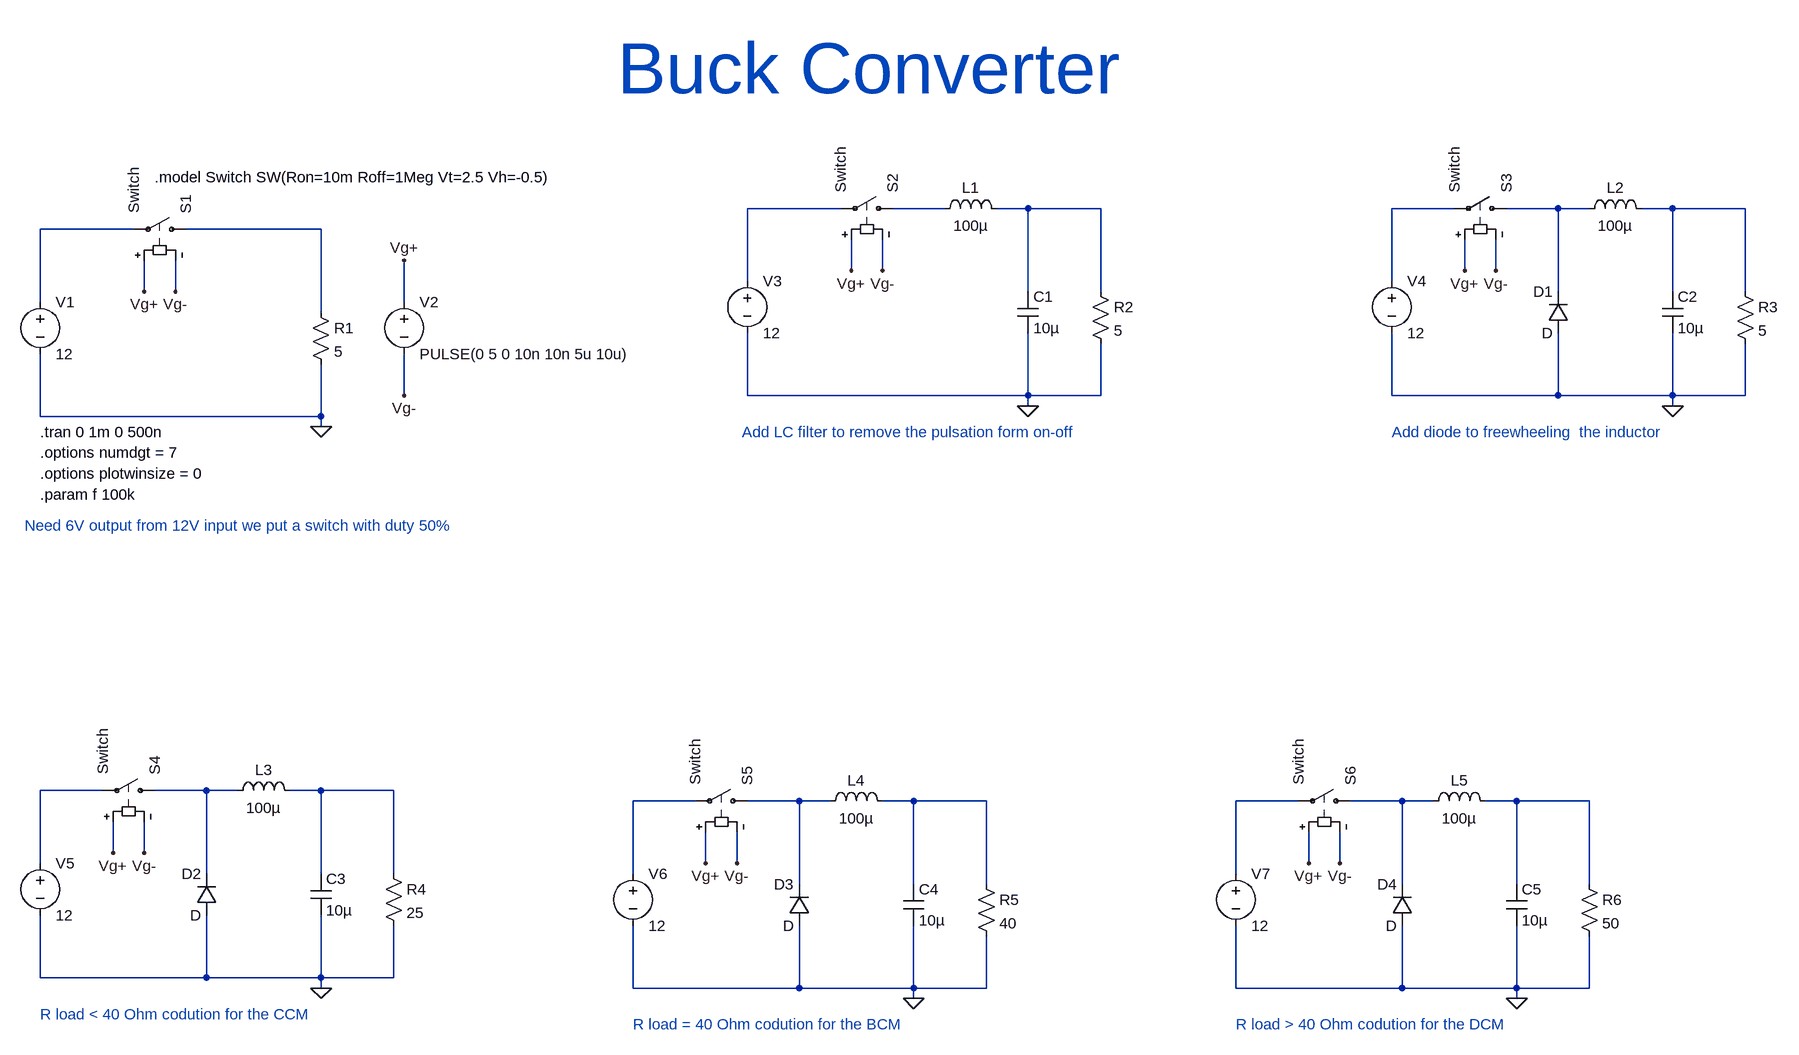
[diagram p0: schematic Buck Converter.asc]
Buck Converter.asc, the LTspice schematic file:
Version 4
SHEET 1 2696 1320
WIRE 1248 16 1104 16
WIRE 1408 16 1328 16
WIRE 1536 16 1488 16
WIRE 1648 16 1536 16
WIRE 2192 16 2096 16
WIRE 2352 16 2272 16
WIRE 2400 16 2352 16
WIRE 2528 16 2480 16
WIRE 2640 16 2528 16
WIRE 160 48 16 48
WIRE 448 48 240 48
WIRE 1264 112 1264 64
WIRE 1312 112 1312 64
WIRE 2208 112 2208 64
WIRE 2256 112 2256 64
WIRE 1104 128 1104 16
WIRE 2096 128 2096 16
WIRE 176 144 176 96
WIRE 224 144 224 96
WIRE 1536 144 1536 16
WIRE 1648 144 1648 16
WIRE 2352 144 2352 16
WIRE 2528 144 2528 16
WIRE 2640 144 2640 16
WIRE 16 160 16 48
WIRE 576 160 576 96
WIRE 448 176 448 48
WIRE 576 304 576 240
WIRE 1104 304 1104 208
WIRE 1536 304 1536 208
WIRE 1536 304 1104 304
WIRE 1648 304 1648 224
WIRE 1648 304 1536 304
WIRE 2096 304 2096 208
WIRE 2352 304 2352 208
WIRE 2352 304 2096 304
WIRE 2528 304 2528 208
WIRE 2528 304 2352 304
WIRE 2640 304 2640 224
WIRE 2640 304 2528 304
WIRE 1536 320 1536 304
WIRE 2528 320 2528 304
WIRE 16 336 16 240
WIRE 448 336 448 256
WIRE 448 336 16 336
WIRE 448 352 448 336
WIRE 112 912 16 912
WIRE 272 912 192 912
WIRE 320 912 272 912
WIRE 448 912 400 912
WIRE 560 912 448 912
WIRE 1024 928 928 928
WIRE 1184 928 1104 928
WIRE 1232 928 1184 928
WIRE 1360 928 1312 928
WIRE 1472 928 1360 928
WIRE 1952 928 1856 928
WIRE 2112 928 2032 928
WIRE 2160 928 2112 928
WIRE 2288 928 2240 928
WIRE 2400 928 2288 928
WIRE 128 1008 128 960
WIRE 176 1008 176 960
WIRE 16 1024 16 912
WIRE 1040 1024 1040 976
WIRE 1088 1024 1088 976
WIRE 1968 1024 1968 976
WIRE 2016 1024 2016 976
WIRE 272 1040 272 912
WIRE 448 1040 448 912
WIRE 560 1040 560 912
WIRE 928 1040 928 928
WIRE 1856 1040 1856 928
WIRE 1184 1056 1184 928
WIRE 1360 1056 1360 928
WIRE 1472 1056 1472 928
WIRE 2112 1056 2112 928
WIRE 2288 1056 2288 928
WIRE 2400 1056 2400 928
WIRE 16 1200 16 1104
WIRE 272 1200 272 1104
WIRE 272 1200 16 1200
WIRE 448 1200 448 1104
WIRE 448 1200 272 1200
WIRE 560 1200 560 1120
WIRE 560 1200 448 1200
WIRE 448 1216 448 1200
WIRE 928 1216 928 1120
WIRE 1184 1216 1184 1120
WIRE 1184 1216 928 1216
WIRE 1360 1216 1360 1120
WIRE 1360 1216 1184 1216
WIRE 1472 1216 1472 1136
WIRE 1472 1216 1360 1216
WIRE 1856 1216 1856 1120
WIRE 2112 1216 2112 1120
WIRE 2112 1216 1856 1216
WIRE 2288 1216 2288 1120
WIRE 2288 1216 2112 1216
WIRE 2400 1216 2400 1136
WIRE 2400 1216 2288 1216
WIRE 1360 1232 1360 1216
WIRE 2288 1232 2288 1216
FLAG 576 96 Vg+
FLAG 576 304 Vg-
FLAG 176 144 Vg+
FLAG 224 144 Vg-
FLAG 448 352 0
FLAG 1264 112 Vg+
FLAG 1312 112 Vg-
FLAG 1536 320 0
FLAG 2208 112 Vg+
FLAG 2256 112 Vg-
FLAG 2528 320 0
FLAG 128 1008 Vg+
FLAG 176 1008 Vg-
FLAG 448 1216 0
FLAG 1040 1024 Vg+
FLAG 1088 1024 Vg-
FLAG 1360 1232 0
FLAG 1968 1024 Vg+
FLAG 2016 1024 Vg-
FLAG 2288 1232 0
SYMBOL voltage 16 144 R0
WINDOW 123 0 0 Left 0
WINDOW 39 0 0 Left 0
SYMATTR InstName V1
SYMATTR Value 12
SYMBOL res 432 160 R0
SYMATTR InstName R1
SYMATTR Value 5
SYMBOL voltage 576 144 R0
WINDOW 123 0 0 Left 0
WINDOW 39 0 0 Left 0
SYMATTR InstName V2
SYMATTR Value PULSE(0 5 0 10n 10n 5u 10u)
SYMBOL sw 256 48 M270
SYMATTR InstName S1
SYMATTR Value Switch
SYMBOL voltage 1104 112 R0
WINDOW 123 0 0 Left 0
WINDOW 39 0 0 Left 0
SYMATTR InstName V3
SYMATTR Value 12
SYMBOL res 1632 128 R0
SYMATTR InstName R2
SYMATTR Value 5
SYMBOL sw 1344 16 M270
SYMATTR InstName S2
SYMATTR Value Switch
SYMBOL ind 1392 32 R270
WINDOW 0 32 56 VTop 2
WINDOW 3 5 56 VBottom 2
SYMATTR InstName L1
SYMATTR Value 100µ
SYMBOL cap 1520 144 R0
SYMATTR InstName C1
SYMATTR Value 10µ
SYMBOL voltage 2096 112 R0
WINDOW 123 0 0 Left 0
WINDOW 39 0 0 Left 0
SYMATTR InstName V4
SYMATTR Value 12
SYMBOL res 2624 128 R0
SYMATTR InstName R3
SYMATTR Value 5
SYMBOL sw 2288 16 M270
SYMATTR InstName S3
SYMATTR Value Switch
SYMBOL ind 2384 32 R270
WINDOW 0 32 56 VTop 2
WINDOW 3 5 56 VBottom 2
SYMATTR InstName L2
SYMATTR Value 100µ
SYMBOL cap 2512 144 R0
SYMATTR InstName C2
SYMATTR Value 10µ
SYMBOL diode 2368 208 R180
WINDOW 0 24 64 Left 2
WINDOW 3 24 0 Left 2
SYMATTR InstName D1
SYMBOL voltage 16 1008 R0
WINDOW 123 0 0 Left 0
WINDOW 39 0 0 Left 0
SYMATTR InstName V5
SYMATTR Value 12
SYMBOL res 544 1024 R0
SYMATTR InstName R4
SYMATTR Value 25
SYMBOL sw 208 912 M270
SYMATTR InstName S4
SYMATTR Value Switch
SYMBOL ind 304 928 R270
WINDOW 0 32 56 VTop 2
WINDOW 3 5 56 VBottom 2
SYMATTR InstName L3
SYMATTR Value 100µ
SYMBOL cap 432 1040 R0
SYMATTR InstName C3
SYMATTR Value 10µ
SYMBOL diode 288 1104 R180
WINDOW 0 24 64 Left 2
WINDOW 3 24 0 Left 2
SYMATTR InstName D2
SYMBOL voltage 928 1024 R0
WINDOW 123 0 0 Left 0
WINDOW 39 0 0 Left 0
SYMATTR InstName V6
SYMATTR Value 12
SYMBOL res 1456 1040 R0
SYMATTR InstName R5
SYMATTR Value 40
SYMBOL sw 1120 928 M270
SYMATTR InstName S5
SYMATTR Value Switch
SYMBOL ind 1216 944 R270
WINDOW 0 32 56 VTop 2
WINDOW 3 5 56 VBottom 2
SYMATTR InstName L4
SYMATTR Value 100µ
SYMBOL cap 1344 1056 R0
SYMATTR InstName C4
SYMATTR Value 10µ
SYMBOL diode 1200 1120 R180
WINDOW 0 24 64 Left 2
WINDOW 3 24 0 Left 2
SYMATTR InstName D3
SYMBOL voltage 1856 1024 R0
WINDOW 123 0 0 Left 0
WINDOW 39 0 0 Left 0
SYMATTR InstName V7
SYMATTR Value 12
SYMBOL res 2384 1040 R0
SYMATTR InstName R6
SYMATTR Value 50
SYMBOL sw 2048 928 M270
SYMATTR InstName S6
SYMATTR Value Switch
SYMBOL ind 2144 944 R270
WINDOW 0 32 56 VTop 2
WINDOW 3 5 56 VBottom 2
SYMATTR InstName L5
SYMATTR Value 100µ
SYMBOL cap 2272 1056 R0
SYMATTR InstName C5
SYMATTR Value 10µ
SYMBOL diode 2128 1120 R180
WINDOW 0 24 64 Left 2
WINDOW 3 24 0 Left 2
SYMATTR InstName D4
TEXT 16 360 Left 2 !.tran 0 1m 0 500n
TEXT 16 392 Left 2 !.options numdgt = 7
TEXT 16 424 Left 2 !.options plotwinsize = 0
TEXT 16 456 Left 2 !.param f 100k
TEXT 192 -32 Left 2 !.model Switch SW(Ron=10m Roff=1Meg Vt=2.5 Vh=-0.5)
TEXT 1096 360 Left 2 ;Add LC filter to remove the pulsation form on-off
TEXT 2096 360 Left 2 ;Add diode to freewheeling  the inductor
TEXT -8 504 Left 2 ;Need 6V output from 12V input we put a switch with duty 50%
TEXT 904 -200 Left 7 ;Buck Converter
TEXT 16 1256 Left 2 ;R load < 40 Ohm codution for the CCM
TEXT 928 1272 Left 2 ;R load = 40 Ohm codution for the BCM
TEXT 1856 1272 Left 2 ;R load > 40 Ohm codution for the DCM

The netlist it stands for:
* Buck Converter.asc
V1 N007 0 12
R1 N008 0 5
V2 Vg+ Vg- PULSE(0 5 0 10n 10n 5u 10u)
S1 N008 N007 Vg+ Vg- Switch
V3 N001 0 12
R2 N003 0 5
S2 N002 N001 Vg+ Vg- Switch
L1 N002 N003 100µ
C1 N003 0 10µ
V4 N004 0 12
R3 N006 0 5
S3 N005 N004 Vg+ Vg- Switch
L2 N005 N006 100µ
C2 N006 0 10µ
D1 0 N005 D
V5 N009 0 12
R4 N011 0 25
S4 N010 N009 Vg+ Vg- Switch
L3 N010 N011 100µ
C3 N011 0 10µ
D2 0 N010 D
V6 N012 0 12
R5 N014 0 40
S5 N013 N012 Vg+ Vg- Switch
L4 N013 N014 100µ
C4 N014 0 10µ
D3 0 N013 D
V7 N015 0 12
R6 N017 0 50
S6 N016 N015 Vg+ Vg- Switch
L5 N016 N017 100µ
C5 N017 0 10µ
D4 0 N016 D
.model D D
.lib standard.dio
.tran 0 1m 0 500n
.options numdgt = 7
.options plotwinsize = 0
.param f 100k
.model Switch SW(Ron=10m Roff=1Meg Vt=2.5 Vh=-0.5)
* Add LC filter to remove the pulsation form on-off
* Add diode to freewheeling  the inductor
* Need 6V output from 12V input we put a switch with duty 50%
* Buck Converter
* R load < 40 Ohm codution for the CCM
* R load = 40 Ohm codution for the BCM
* R load > 40 Ohm codution for the DCM
.backanno
.end